# EAGLE schematic Wiring (EAGLE 9.2.2)
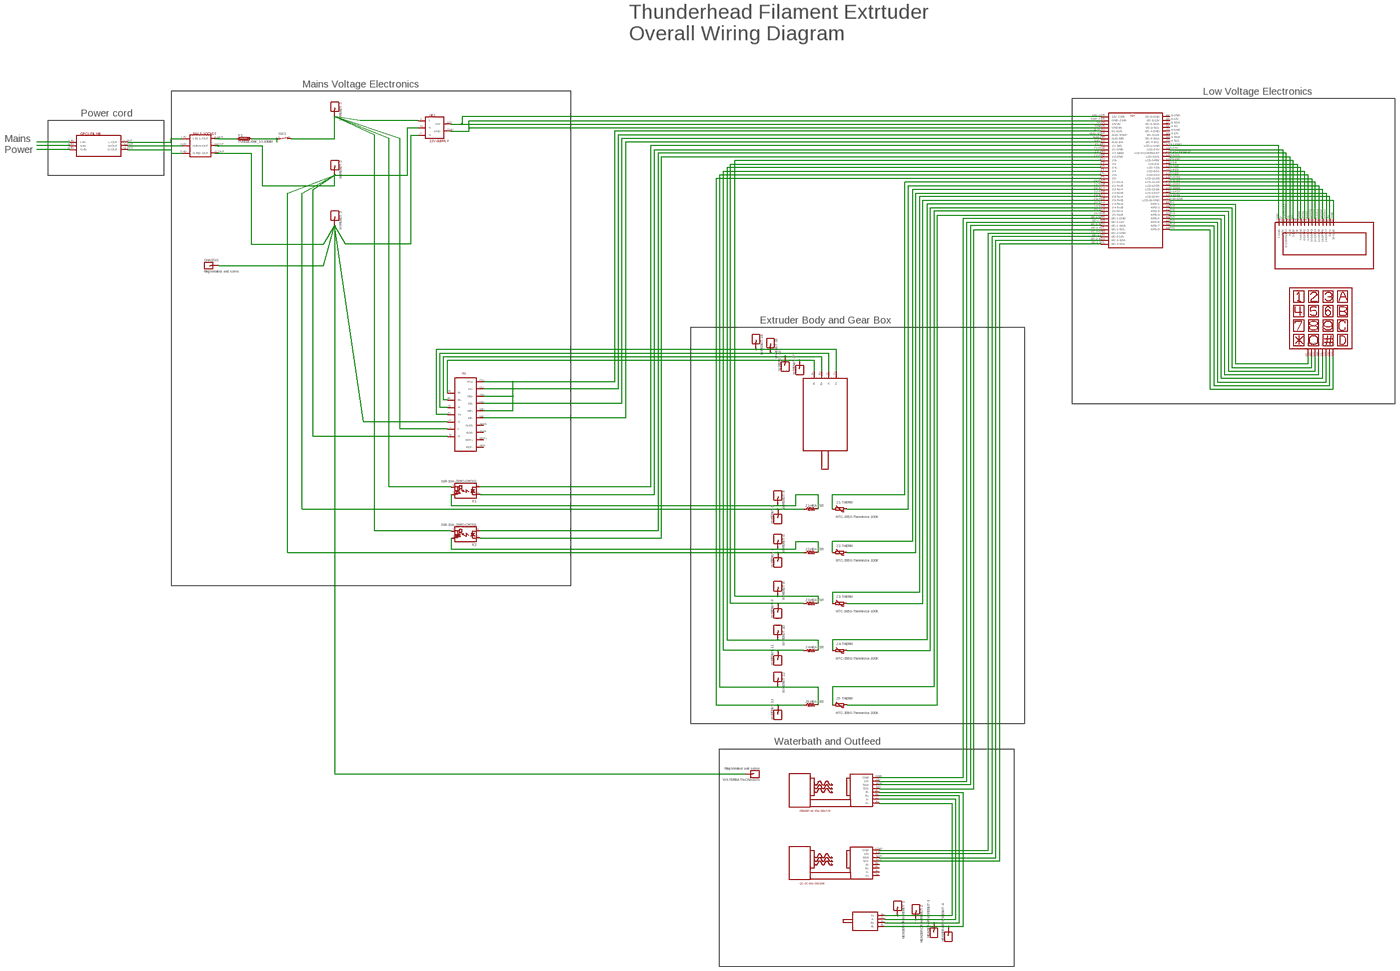
[diagram p0: schematic, sheet 1, overview]
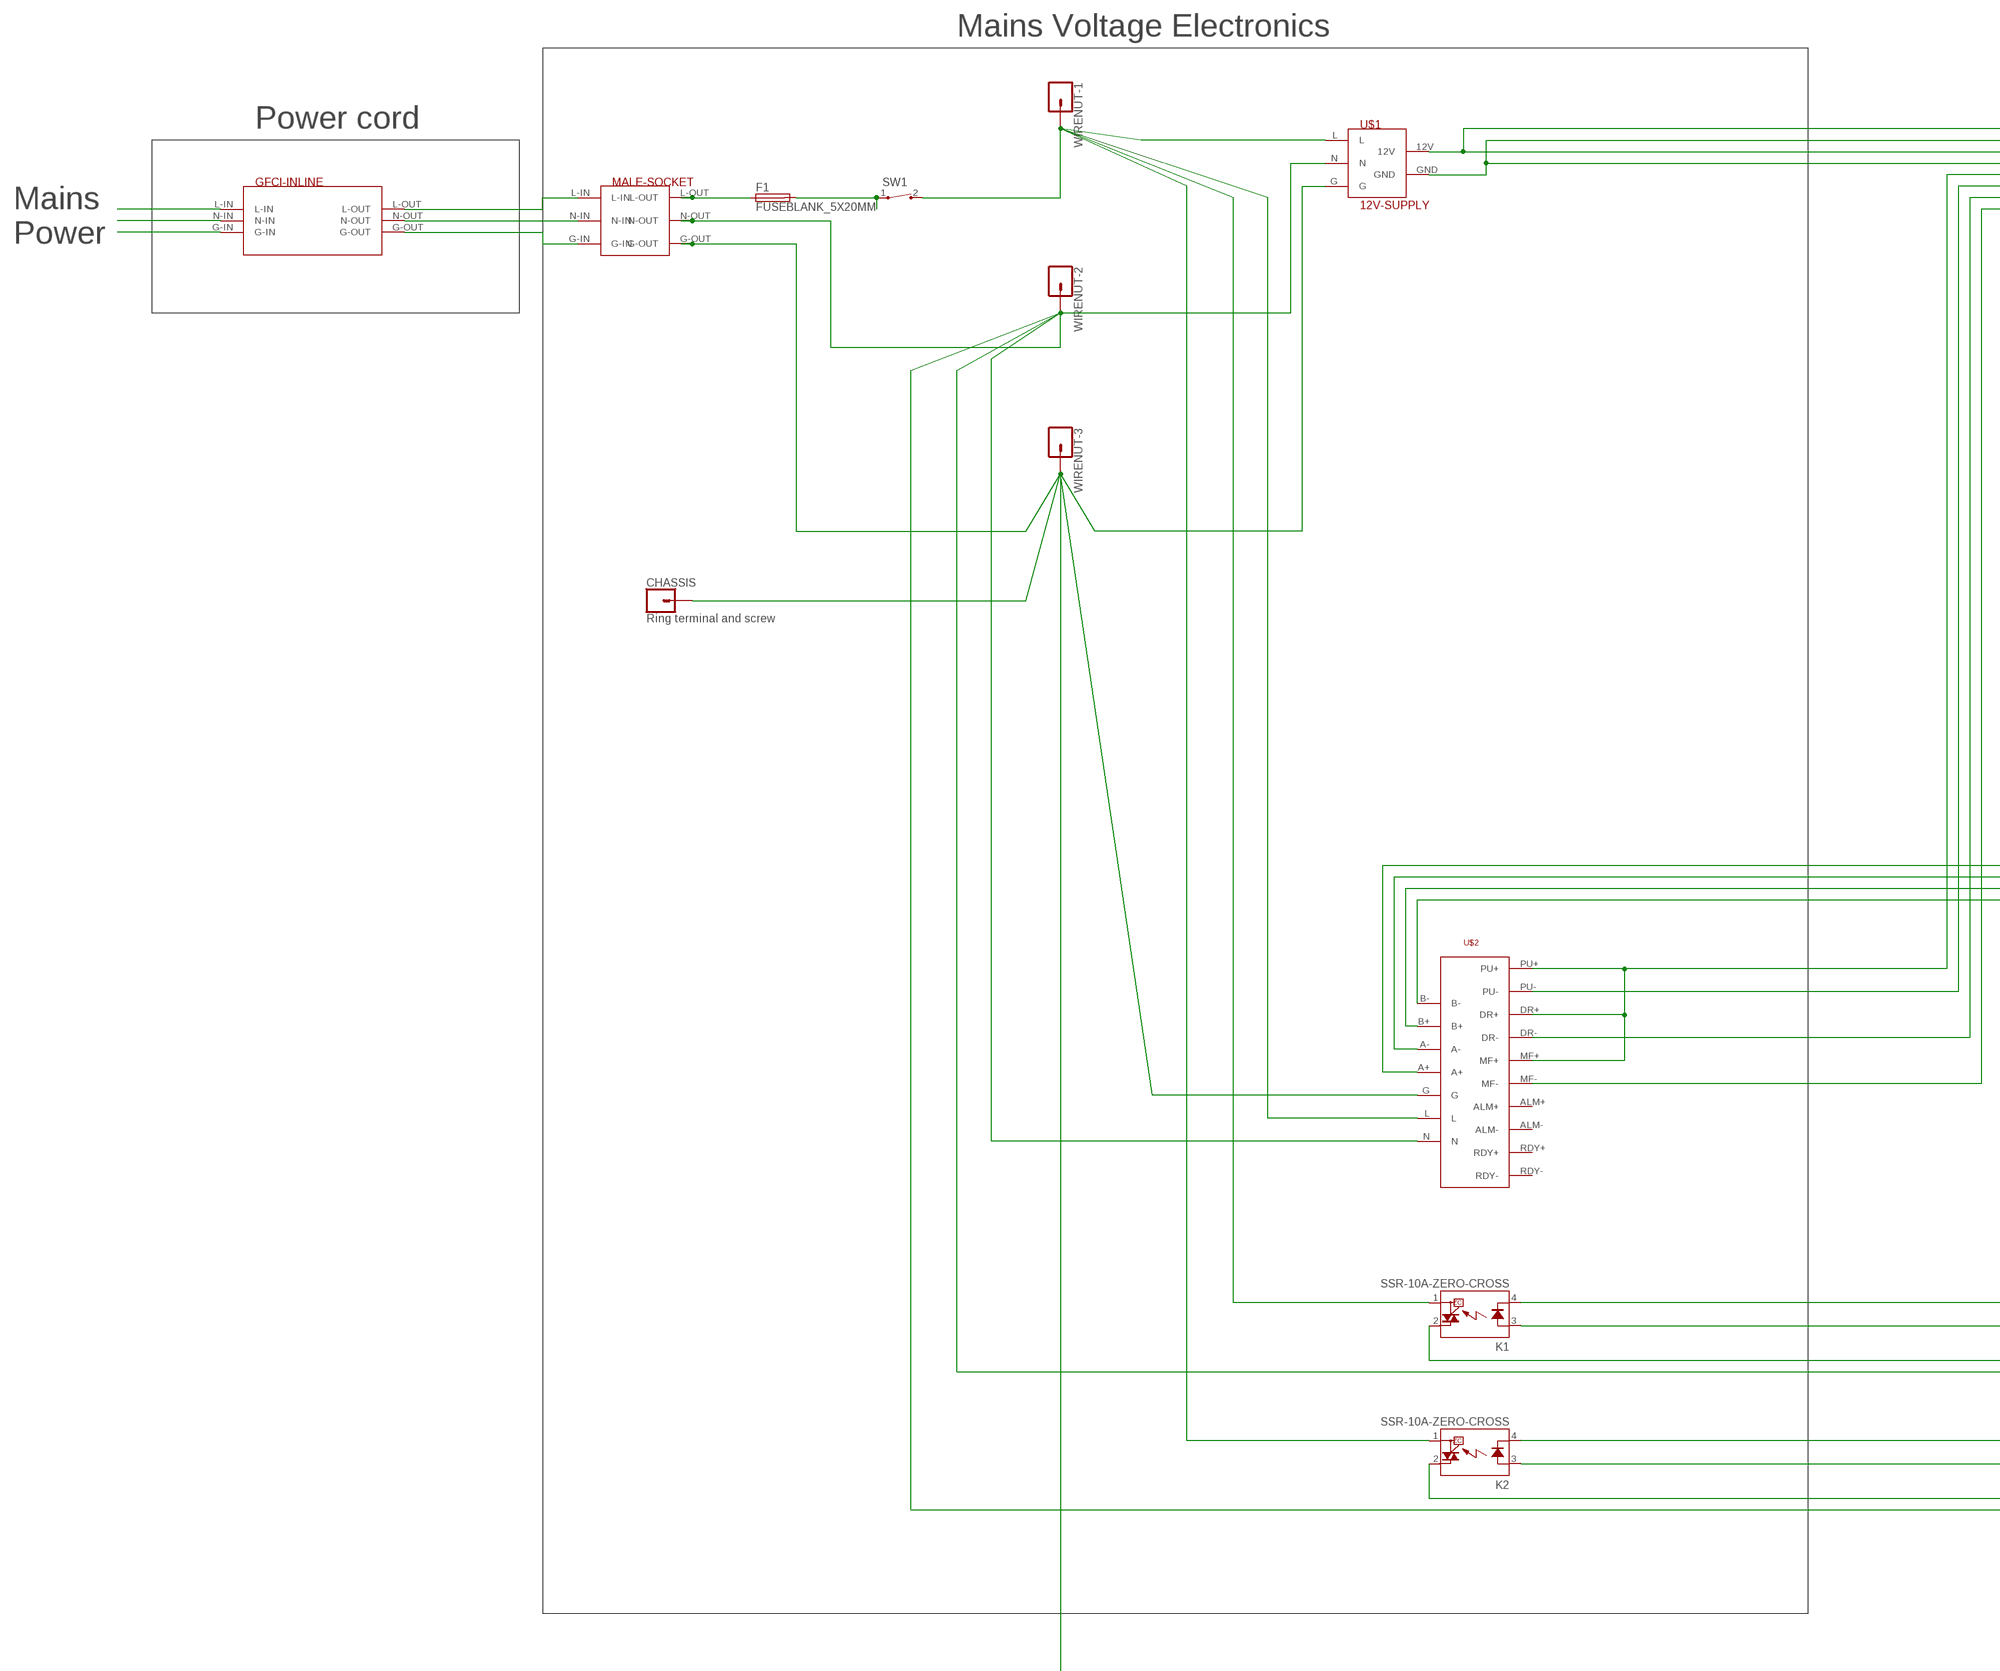
[diagram p1: schematic, sheet 1, part 1 of 4]
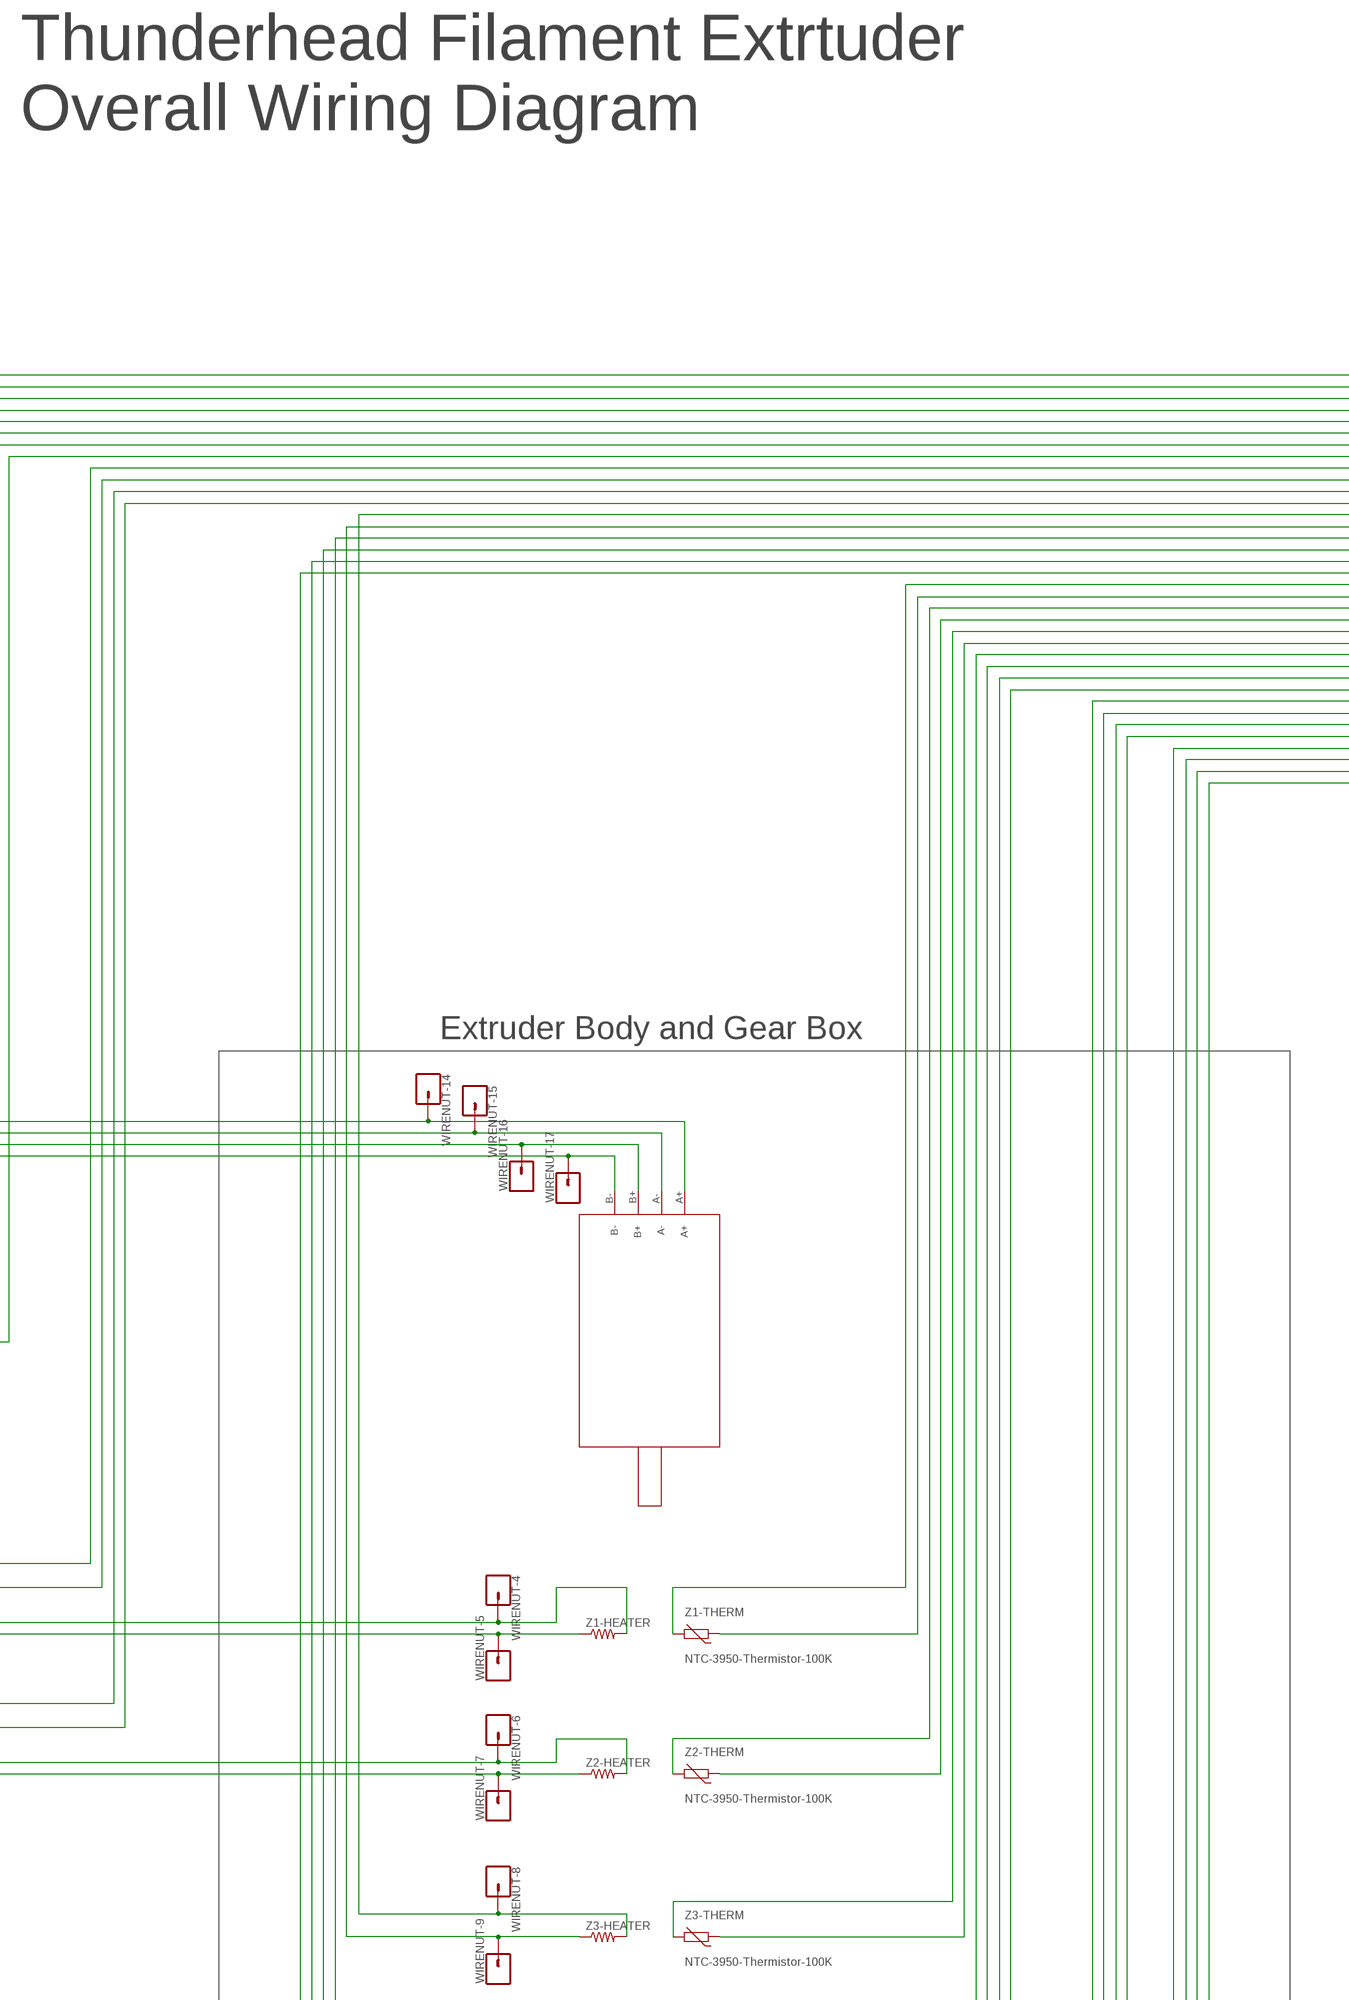
[diagram p2: schematic, sheet 1, part 2 of 4]
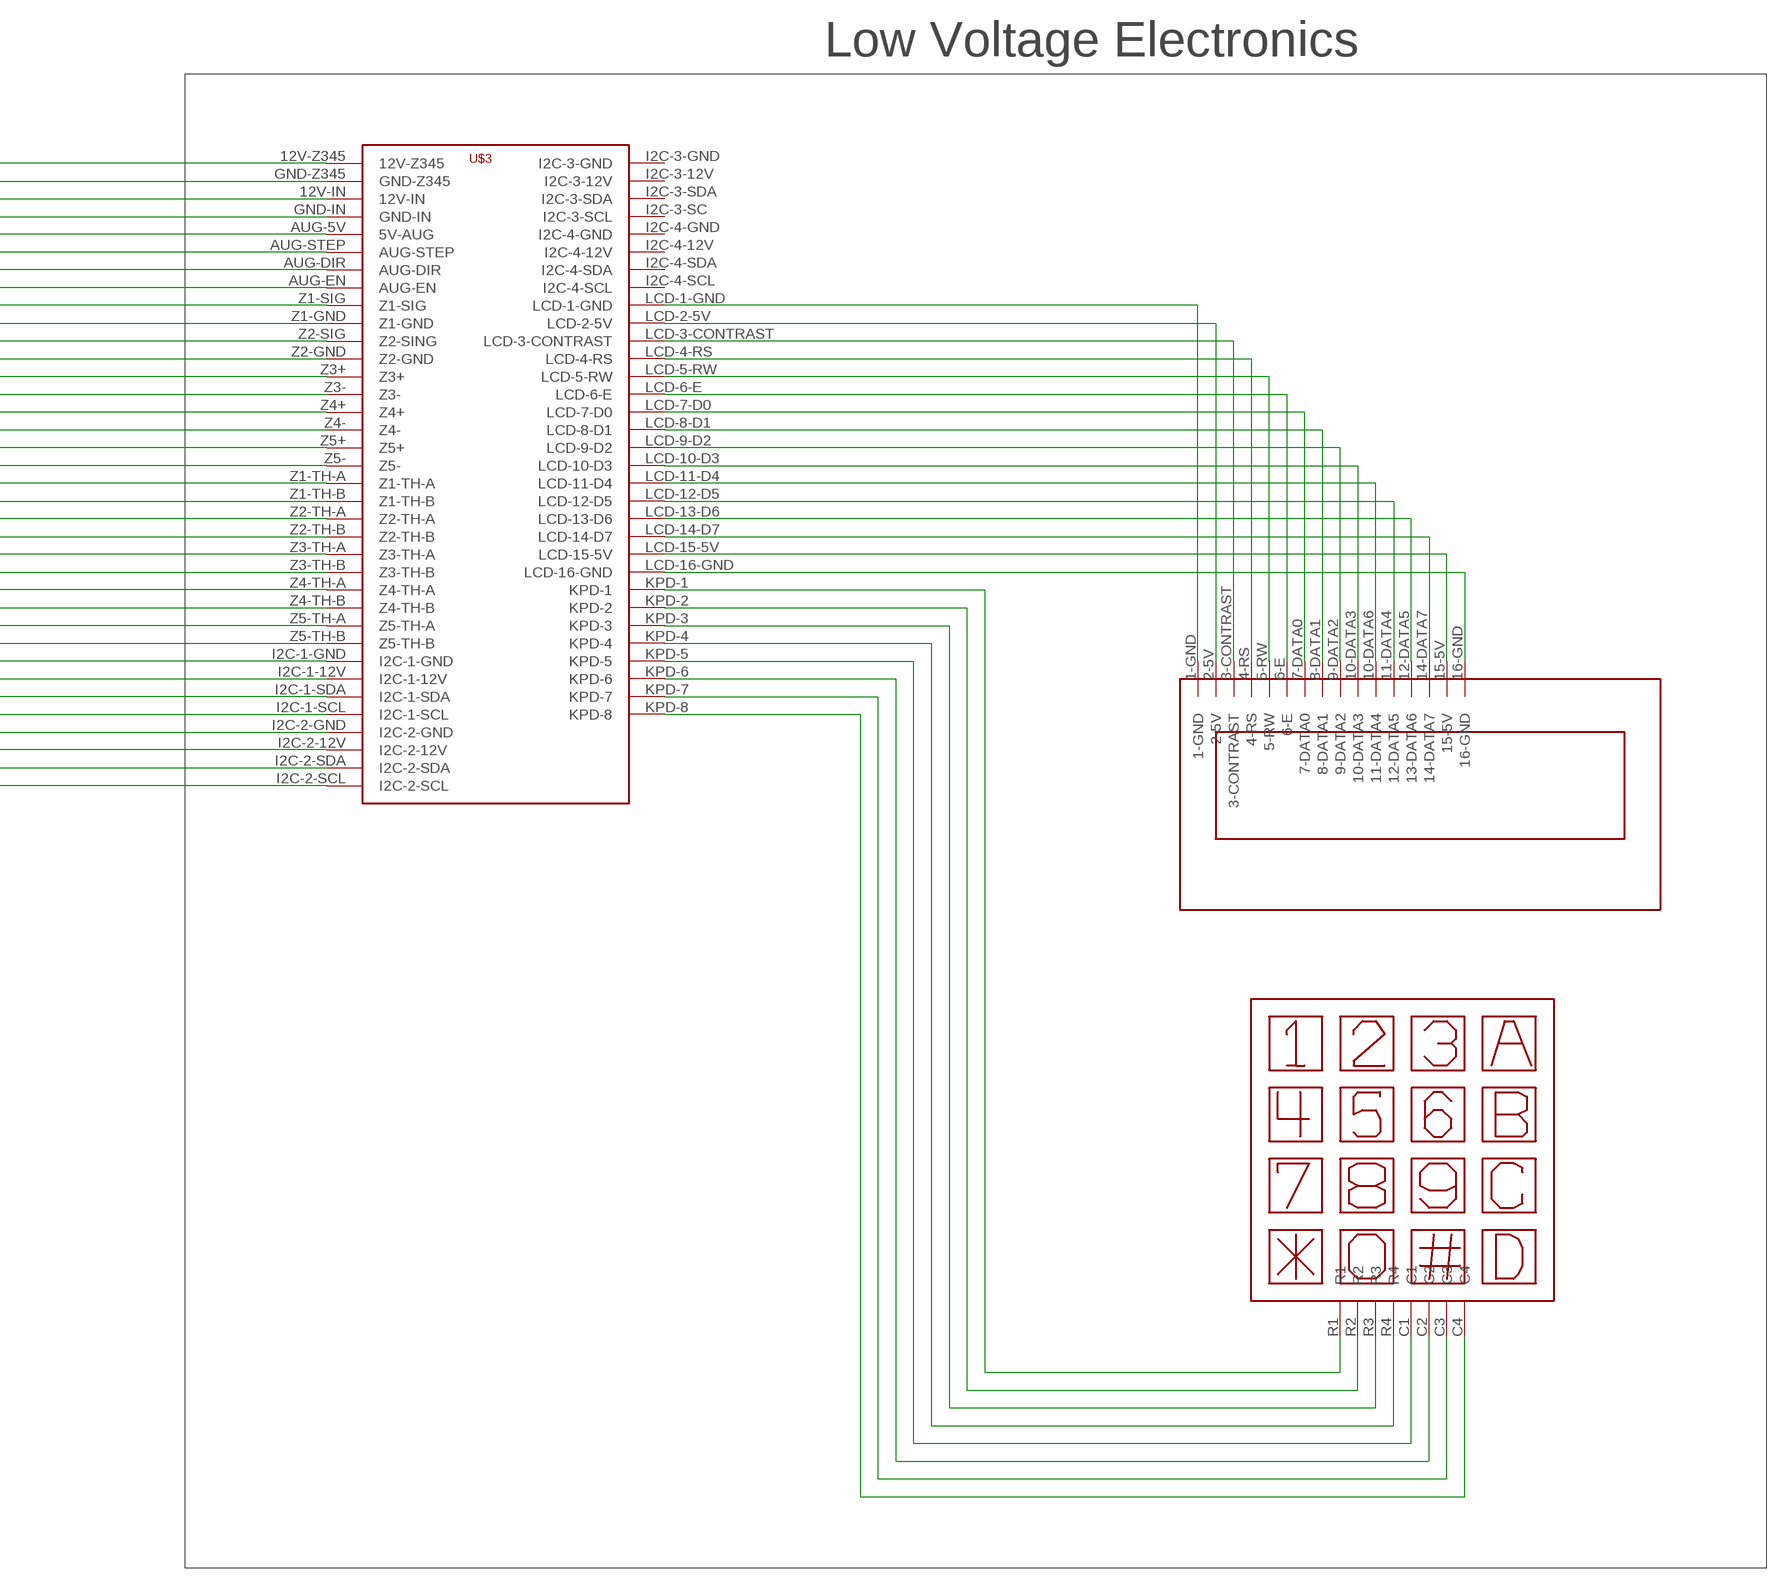
[diagram p3: schematic, sheet 1, part 3 of 4]
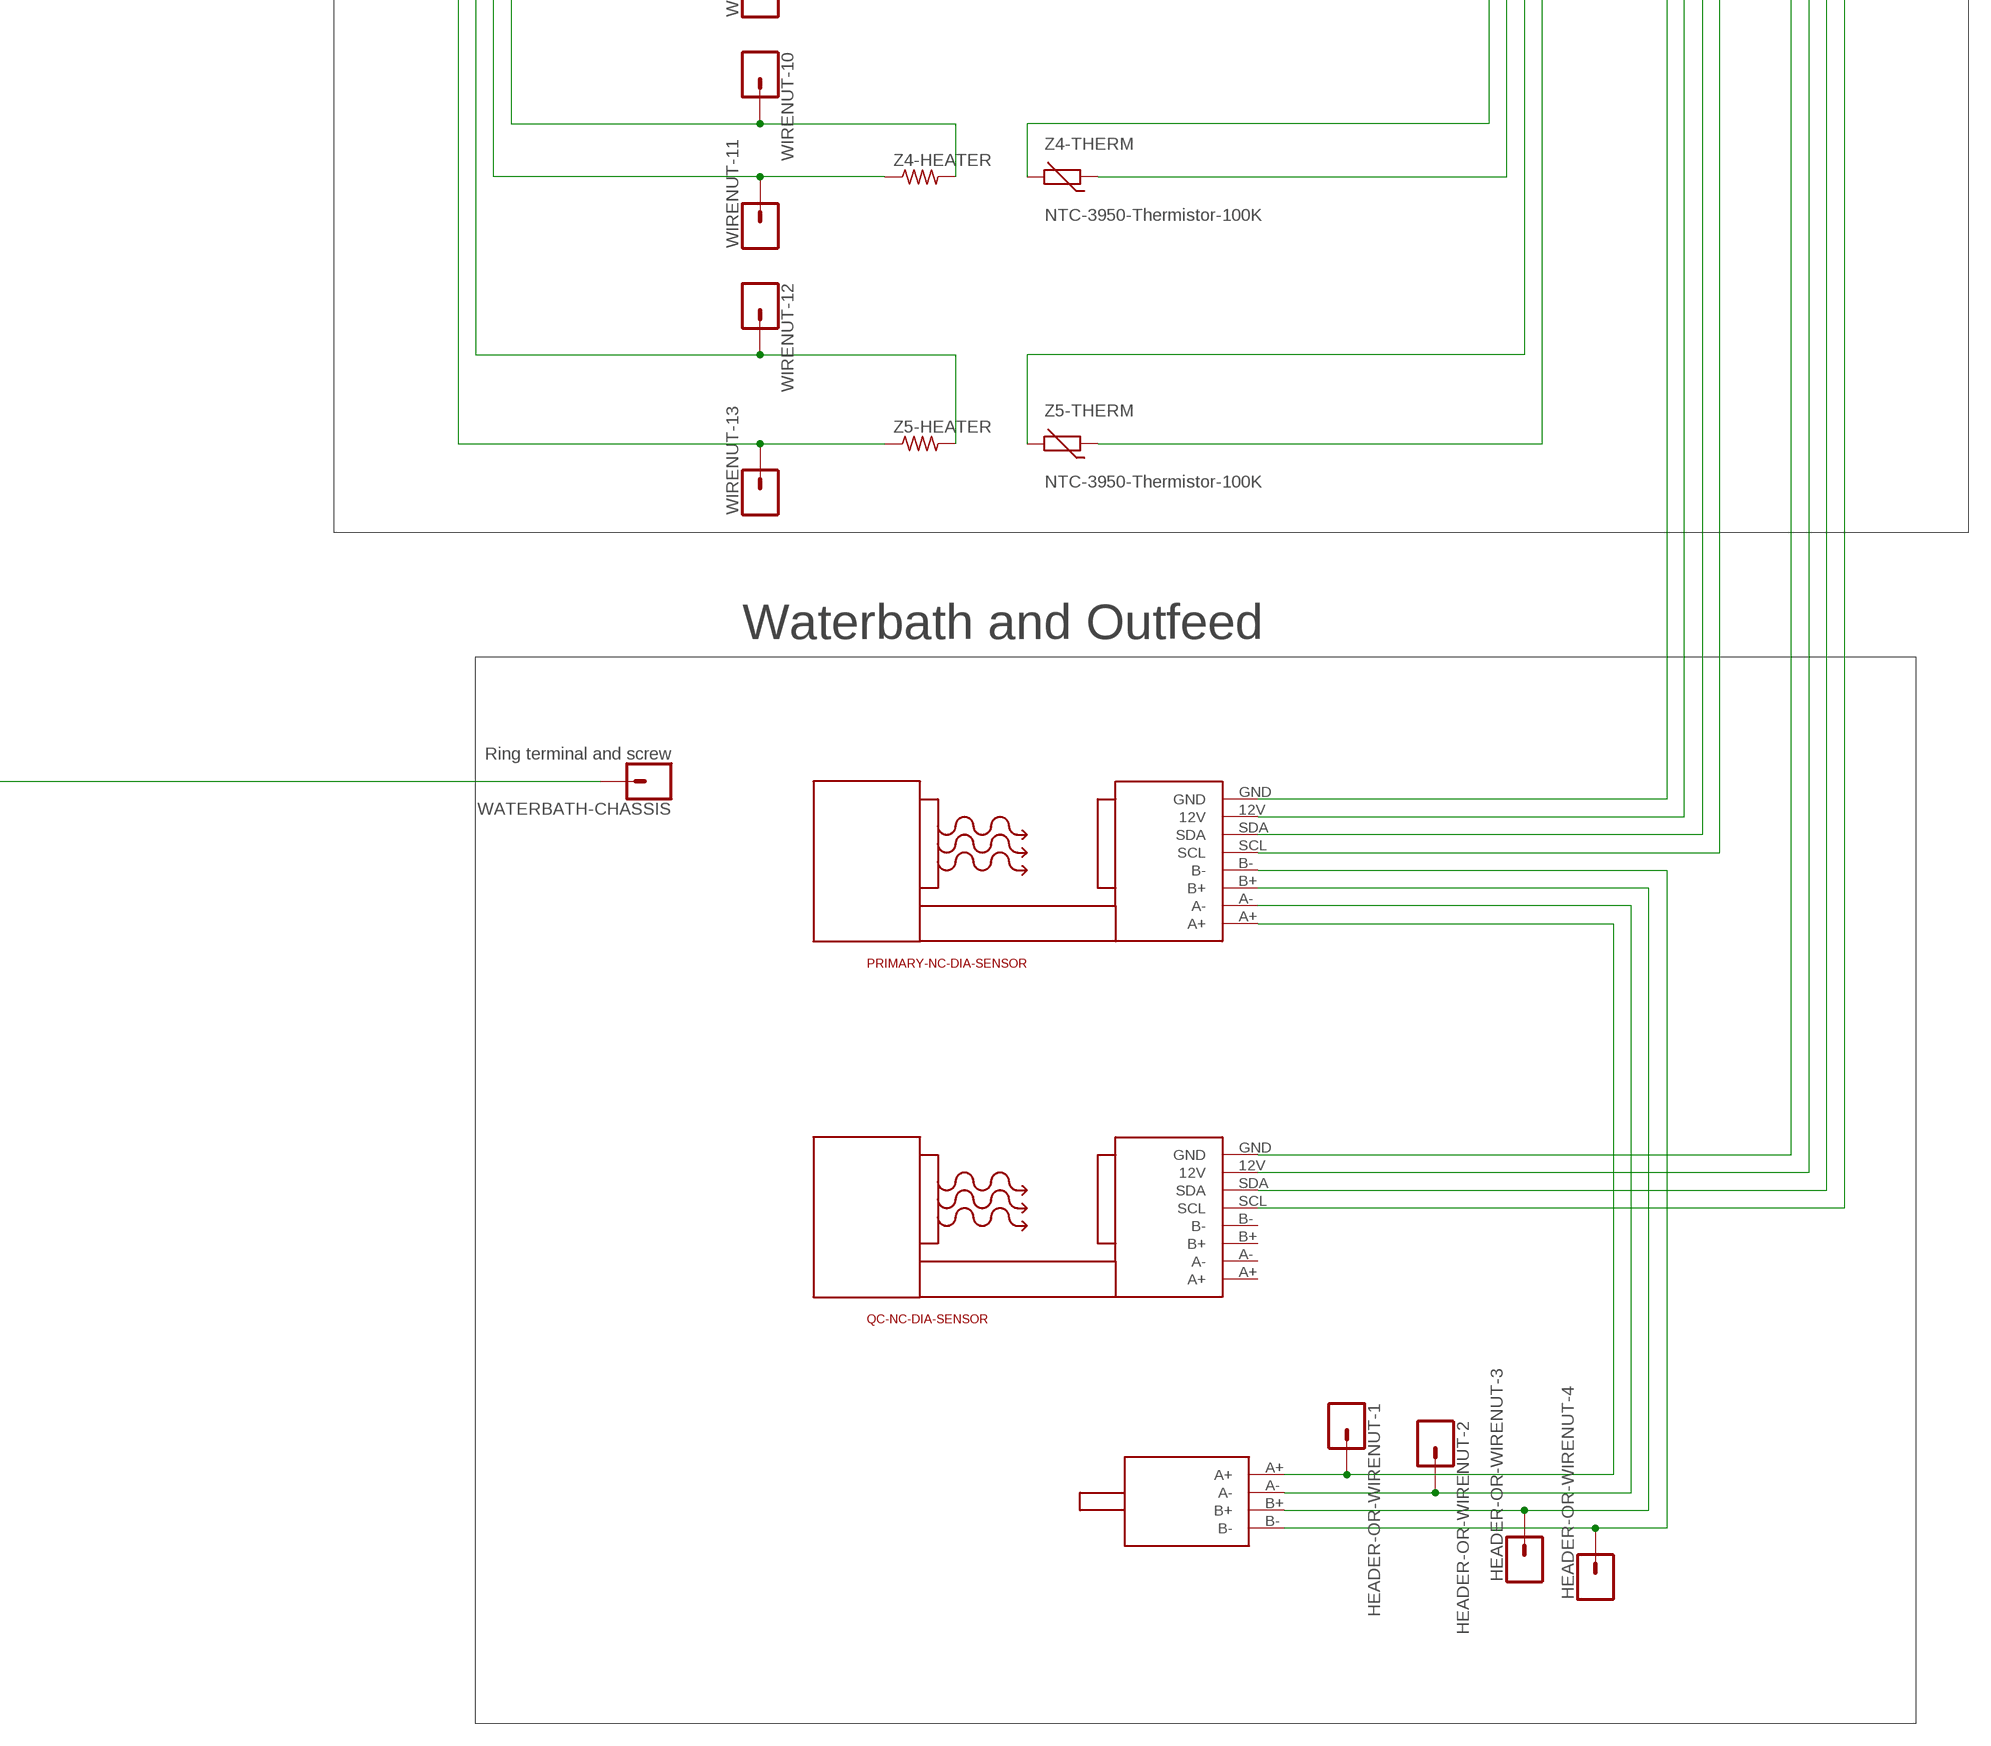
[diagram p4: schematic, sheet 1, part 4 of 4]

## Parts
CHASSIS  Ring terminal and screw  CONN_01  [1X01]
F1  FUSEBLANK_5X20MM  [FUSE_HOLDER_5X20MM]
GFCI-INLINE  GFCI-INLINE  [GFCI-INLINE]
HEADER-OR-WIRENUT-1  CONN_01  [1X01]
HEADER-OR-WIRENUT-2  CONN_01  [1X01]
HEADER-OR-WIRENUT-3  CONN_01  [1X01]
HEADER-OR-WIRENUT-4  CONN_01  [1X01]
K1  SSR-10A-ZERO-CROSS  [SSR-10A-ZERO-CROSS]
K2  SSR-10A-ZERO-CROSS  [SSR-10A-ZERO-CROSS]
MALE-SOCKET  MALE-SOCKET  [MALE-SOCKET]
PRIMARY-NC-DIA-SENSOR  NON-CONTACT-DIA-SENSOR  [NON-CONTACT-DIA-SENSOR]
QC-NC-DIA-SENSOR  NON-CONTACT-DIA-SENSOR  [NON-CONTACT-DIA-SENSOR]
SW1  CT10-XXXX-A2  [CT10-XXXX-A2]
U$1  12V-SUPPLY  [12V-SUPPLY]
U$2  DM2722A  [DM2722A]
U$3  THUNDERBOARD  [THUNDERBOARD]
U$5  STEPPER-MOTOR-NEMA42  [STEPPER-MOTOR-NEMA42]
U$6  STEPPER-MOTOR-NEMA17  [STEPPER-MOTOR-NEMA17]
U$7  LCD-2004  [LCD-2004]
U$8  KEYPAD  [KEYPAD]
WATERBATH-CHASSIS  Ring terminal and screw  CONN_01  [1X01]
WIRENUT-1  CONN_01  [1X01]
WIRENUT-2  CONN_01  [1X01]
WIRENUT-3  CONN_01  [1X01]
WIRENUT-4  CONN_01  [1X01]
WIRENUT-5  CONN_01  [1X01]
WIRENUT-6  CONN_01  [1X01]
WIRENUT-7  CONN_01  [1X01]
WIRENUT-8  CONN_01  [1X01]
WIRENUT-9  CONN_01  [1X01]
WIRENUT-10  CONN_01  [1X01]
WIRENUT-11  CONN_01  [1X01]
WIRENUT-12  CONN_01  [1X01]
WIRENUT-13  CONN_01  [1X01]
WIRENUT-14  CONN_01  [1X01]
WIRENUT-15  CONN_01  [1X01]
WIRENUT-16  CONN_01  [1X01]
WIRENUT-17  CONN_01  [1X01]
Z1-HEATER  R-US_0204/2V  [0204V]
Z1-THERM  NTC-3950-Thermistor-100K  THERMISTOR-2,5  [RS-2,5]
Z2-HEATER  R-US_0204/2V  [0204V]
Z2-THERM  NTC-3950-Thermistor-100K  THERMISTOR-2,5  [RS-2,5]
Z3-HEATER  R-US_0204/2V  [0204V]
Z3-THERM  NTC-3950-Thermistor-100K  THERMISTOR-2,5  [RS-2,5]
Z4-HEATER  R-US_0204/2V  [0204V]
Z4-THERM  NTC-3950-Thermistor-100K  THERMISTOR-2,5  [RS-2,5]
Z5-HEATER  R-US_0204/2V  [0204V]
Z5-THERM  NTC-3950-Thermistor-100K  THERMISTOR-2,5  [RS-2,5]

## Nets
N$1: F1.1 MALE-SOCKET.L-OUT
N$2: F1.2 SW1.1
N$3: U$1.12V U$3.12V-IN U$3.12V-Z345
N$4: MALE-SOCKET.N-OUT U$1.N U$2.N WIRENUT-2.1 WIRENUT-5.1 WIRENUT-7.1 Z1-HEATER.1 Z2-HEATER.1
N$5: CHASSIS.1 MALE-SOCKET.G-OUT U$1.G U$2.G WATERBATH-CHASSIS.1 WIRENUT-3.1
N$6: U$1.GND U$3.GND-IN U$3.GND-Z345
N$7: U$2.DR+ U$2.MF+ U$2.PU+ U$3.AUG-5V(5V-AUG)
N$8: U$2.PU- U$3.AUG-STEP
N$9: K1.1 K2.1 SW1.2 U$1.L U$2.L WIRENUT-1.1
N$10: U$2.DR- U$3.AUG-DIR
N$11: U$2.MF- U$3.AUG-EN
N$12: U$3.Z1-TH-A Z1-THERM.2
N$13: U$3.Z1-TH-B Z1-THERM.1
N$14: U$3.Z2-TH-A Z2-THERM.2
N$15: U$3.Z5-TH-B Z5-THERM.1
N$16: U$3.Z5-TH-A Z5-THERM.2
N$17: U$3.Z4-TH-B Z4-THERM.1
N$18: U$3.Z4-TH-A Z4-THERM.2
N$19: U$3.Z3-TH-B Z3-THERM.1
N$20: U$3.Z3-TH-A Z3-THERM.2
N$21: U$3.Z2-TH-B Z2-THERM.1
N$22: U$3.Z5- WIRENUT-13.1 Z5-HEATER.1
N$23: U$3.Z5+ WIRENUT-12.1 Z5-HEATER.2
N$24: U$3.Z4- WIRENUT-11.1 Z4-HEATER.1
N$25: U$3.Z4+ WIRENUT-10.1 Z4-HEATER.2
N$26: U$3.Z3- WIRENUT-9.1 Z3-HEATER.1
N$27: U$3.Z3+ WIRENUT-8.1 Z3-HEATER.2
N$28: K1.2 WIRENUT-4.1 Z1-HEATER.2
N$29: K1.4 U$3.Z1-SIG
N$30: K2.2 WIRENUT-6.1 Z2-HEATER.2
N$31: K2.3 U$3.Z2-GND
N$32: U$2.B- U$5.B- WIRENUT-17.1
N$33: U$2.B+ U$5.B+ WIRENUT-16.1
N$34: U$2.A- U$5.A- WIRENUT-15.1
N$35: U$2.A+ U$5.A+ WIRENUT-14.1
N$36: K1.3 U$3.Z1-GND
N$37: K2.4 U$3.Z2-SIG(Z2-SING)
N$38: PRIMARY-NC-DIA-SENSOR.GND U$3.I2C-1-GND
N$39: PRIMARY-NC-DIA-SENSOR.12V U$3.I2C-1-12V
N$40: PRIMARY-NC-DIA-SENSOR.SDA U$3.I2C-1-SDA
N$41: PRIMARY-NC-DIA-SENSOR.SCL U$3.I2C-1-SCL
N$42: QC-NC-DIA-SENSOR.GND U$3.I2C-2-GND
N$43: QC-NC-DIA-SENSOR.12V U$3.I2C-2-12V
N$44: QC-NC-DIA-SENSOR.SDA U$3.I2C-2-SDA
N$45: QC-NC-DIA-SENSOR.SCL U$3.I2C-2-SCL
N$46: HEADER-OR-WIRENUT-1.1 PRIMARY-NC-DIA-SENSOR.A+ U$6.A+
N$47: HEADER-OR-WIRENUT-2.1 PRIMARY-NC-DIA-SENSOR.A- U$6.A-
N$48: HEADER-OR-WIRENUT-3.1 PRIMARY-NC-DIA-SENSOR.B+ U$6.B+
N$49: HEADER-OR-WIRENUT-4.1 PRIMARY-NC-DIA-SENSOR.B- U$6.B-
N$50: U$3.LCD-16-GND U$7.16-GND
N$51: U$3.LCD-15-5V U$7.15-5V
N$52: U$3.LCD-14-D7 U$7.14-DATA7
N$53: U$3.LCD-13-D6 U$7.12-DATA5(13-DATA6)
N$54: U$3.LCD-12-D5 U$7.11-DATA4(12-DATA5)
N$55: U$3.LCD-11-D4 U$7.10-DATA6(11-DATA4)
N$56: U$3.LCD-10-D3 U$7.10-DATA3
N$57: U$3.LCD-9-D2 U$7.9-DATA2
N$58: U$3.LCD-8-D1 U$7.8-DATA1
N$59: U$3.LCD-7-D0 U$7.7-DATA0
N$60: U$3.LCD-6-E U$7.6-E
N$61: U$3.LCD-5-RW U$7.5-RW
N$62: U$3.LCD-4-RS U$7.4-RS
N$63: U$3.LCD-3-CONTRAST U$7.3-CONTRAST
N$64: U$3.LCD-2-5V U$7.2-5V
N$65: U$3.LCD-1-GND U$7.1-GND
N$66: U$3.KPD-1 U$8.R1
N$67: U$3.KPD-2 U$8.R2
N$68: U$3.KPD-3 U$8.R3
N$69: U$3.KPD-4 U$8.R4
N$70: U$3.KPD-5 U$8.C1
N$71: U$3.KPD-6 U$8.C2
N$72: U$3.KPD-7 U$8.C3
N$73: U$3.KPD-8 U$8.C4
N$74: GFCI-INLINE.L-OUT MALE-SOCKET.L-IN
N$75: GFCI-INLINE.N-OUT MALE-SOCKET.N-IN
N$76: GFCI-INLINE.G-OUT MALE-SOCKET.G-IN
N$77: GFCI-INLINE.L-IN
N$78: GFCI-INLINE.N-IN
N$79: GFCI-INLINE.G-IN
Unconnected: QC-NC-DIA-SENSOR.A+ QC-NC-DIA-SENSOR.A- QC-NC-DIA-SENSOR.B+ QC-NC-DIA-SENSOR.B- U$2.ALM+ U$2.ALM- U$2.RDY+ U$2.RDY- U$3.I2C-3-12V U$3.I2C-3-GND U$3.I2C-3-SC(I2C-3-SCL) U$3.I2C-3-SDA U$3.I2C-4-12V U$3.I2C-4-GND U$3.I2C-4-SCL U$3.I2C-4-SDA

## Notes on the sheet
- Thunderhead Filament Extrtuder
  Overall Wiring Diagram
- Mains Voltage Electronics
- Low Voltage Electronics
- Power cord
- Mains
  Power
- Extruder Body and Gear Box
- Waterbath and Outfeed

## Library data of the parts
CHASSIS HEADER-OR-WIRENUT-1-HEADER-OR-WIRENUT-4 WATERBATH-CHASSIS WIRENUT-1-WIRENUT-17 = SparkFun-Connectors:CONN_01: Single connection point. Often used as Generic Header-pin footprint for 0.1 inch spaced/style header connections On any of the 0.1 inch spaced packages, you can populate with these: Break Away Headers - Straight <https://www.sparkfun.com/products/116> (PRT-00116) Break Away Male Headers - Right Angle <https://www.sparkfun.com/products/553> (PRT-00553) Female Headers <https://www.sparkfun.com/products/115> (PRT-00115) Break Away Headers - Machine Pin <https://www.sparkfun.com/products/117> (PRT-00117) Break Away Female Headers - Swiss Machine Pin <https://www.sparkfun.com/products/743> (PRT-00743) This device is also useful as a general connection point to wire up your design to another part of your project. Our various solder wires solder well into these plated through hole pads. Hook-Up Wire - Assortment (Stranded, 22 AWG) <https://www.sparkfun.com/products/11375> (PRT-11375) Hook-Up Wire - Assortment (Solid Core, 22 AWG) <https://www.sparkfun.com/products/11367> (PRT-11367) View the entire wire category on our website here <https://www.sparkfun.com/categories/141> Special notes: SMTSO-256-ET is a "flush mount" nut for a 4-40 screw. We mostly use this on specialty testbeds; it is a nice way to connect hardware to your PCB at an adjustable hieght. Also note, the SNAP packages are for using a snappable style connector. We sell a baggie of snaps and they are also used on two LilyPad designs: Snap Assortment - 30 pack (male and female) <https://www.sparkfun.com/products/11347> (DEV-11347) LilyPad Arduino SimpleSnap <https://www.sparkfun.com/products/10941> (DEV-10941) LilyPad SimpleSnap Protoboard <https://www.sparkfun.com/products/10940> (DEV-10940)
F1 = fuse:FUSE: Fuse; OC_FARNELL: unknown; OC_NEWARK: unknown
GFCI-INLINE = Edited Parts:GFCI-INLINE
K1 K2 = Edited Parts:SSR-10A-ZERO-CROSS: SOLID STATE RELAY 3 - 32 VDC Control, 10A 24 - 280 VAC-OUT(Zero-crossing)
MALE-SOCKET = Edited Parts:MALE-SOCKET
PRIMARY-NC-DIA-SENSOR QC-NC-DIA-SENSOR = Edited Parts:NON-CONTACT-DIA-SENSOR
SW1 = switch-coto:CT10-XXXX-: CT10 Series Molded Switch Source: www.cotorelay.com .. Coto_Technology__CT10-1530-G1.pdf
U$1 = Edited Parts:12V-SUPPLY
U$2 = Edited Parts:DM2722A
U$3 = Edited Parts:THUNDERBOARD
U$5 = Edited Parts:STEPPER-MOTOR-NEMA42
U$6 = Edited Parts:STEPPER-MOTOR-NEMA17
U$7 = Edited Parts:LCD-2004
U$8 = Edited Parts:KEYPAD
Z1-HEATER Z2-HEATER Z3-HEATER Z4-HEATER Z5-HEATER = resistor - edit:R-US_: RESISTOR, American symbol
Z1-THERM Z2-THERM Z3-THERM Z4-THERM Z5-THERM = varistor:THERMISTOR: THERMISTOR